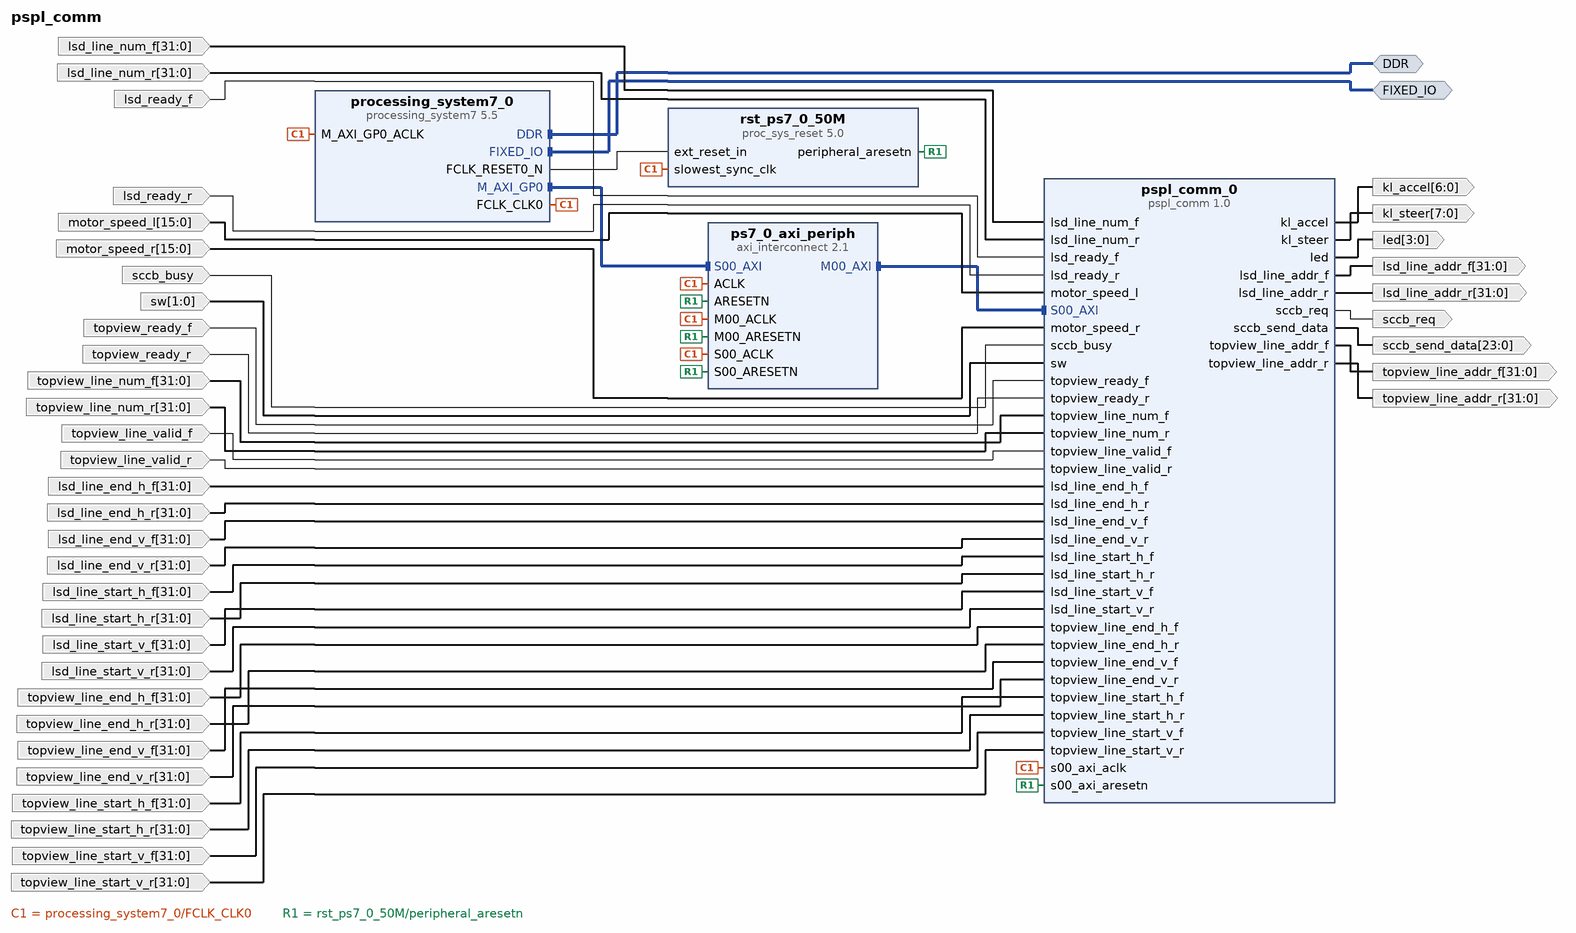
[diagram p0: block diagram of the top level]
# Vivado block design pspl_comm, xc7z020clg400-1, Vivado 2018.3
create_bd_design pspl_comm

create_bd_intf_port -mode Master -vlnv xilinx.com:interface:ddrx_rtl:1.0 DDR
create_bd_intf_port -mode Master -vlnv xilinx.com:display_processing_system7:fixedio_rtl:1.0 FIXED_IO
create_bd_port -dir O -from 3 -to 0 led
create_bd_port -dir O -from 31 -to 0 lsd_line_addr_f
create_bd_port -dir O -from 31 -to 0 lsd_line_addr_r
create_bd_port -dir I -from 31 -to 0 lsd_line_num_f
create_bd_port -dir I -from 31 -to 0 lsd_line_num_r
create_bd_port -dir I lsd_ready_f
create_bd_port -dir I lsd_ready_r
create_bd_port -dir I -from 15 -to 0 motor_speed_l
create_bd_port -dir I -from 15 -to 0 motor_speed_r
create_bd_port -dir I sccb_busy
create_bd_port -dir O sccb_req
create_bd_port -dir O -from 23 -to 0 sccb_send_data
create_bd_port -dir I -from 1 -to 0 sw
create_bd_port -dir O -from 31 -to 0 topview_line_addr_f
create_bd_port -dir O -from 31 -to 0 topview_line_addr_r
create_bd_port -dir I topview_ready_f
create_bd_port -dir I topview_ready_r
create_bd_port -dir O -from 6 -to 0 kl_accel
create_bd_port -dir O -from 7 -to 0 kl_steer
create_bd_port -dir I -from 31 -to 0 topview_line_num_f
create_bd_port -dir I -from 31 -to 0 topview_line_num_r
create_bd_port -dir I topview_line_valid_f
create_bd_port -dir I topview_line_valid_r
create_bd_port -dir I -from 31 -to 0 lsd_line_end_h_f
create_bd_port -dir I -from 31 -to 0 lsd_line_end_h_r
create_bd_port -dir I -from 31 -to 0 lsd_line_end_v_f
create_bd_port -dir I -from 31 -to 0 lsd_line_end_v_r
create_bd_port -dir I -from 31 -to 0 lsd_line_start_h_f
create_bd_port -dir I -from 31 -to 0 lsd_line_start_h_r
create_bd_port -dir I -from 31 -to 0 lsd_line_start_v_f
create_bd_port -dir I -from 31 -to 0 lsd_line_start_v_r
create_bd_port -dir I -from 31 -to 0 topview_line_end_h_f
create_bd_port -dir I -from 31 -to 0 topview_line_end_h_r
create_bd_port -dir I -from 31 -to 0 topview_line_end_v_f
create_bd_port -dir I -from 31 -to 0 topview_line_end_v_r
create_bd_port -dir I -from 31 -to 0 topview_line_start_h_f
create_bd_port -dir I -from 31 -to 0 topview_line_start_h_r
create_bd_port -dir I -from 31 -to 0 topview_line_start_v_f
create_bd_port -dir I -from 31 -to 0 topview_line_start_v_r

create_bd_cell -type ip -vlnv xilinx.com:ip:processing_system7:5.5 processing_system7_0
# 1 more settings of processing_system7_0 are not shown: defaults, MIO pin electricals, DDR timing, and values the tool derives
create_bd_cell -type ip -vlnv xilinx.com:ip:axi_interconnect:2.1 ps7_0_axi_periph
set_property -dict {CONFIG.NUM_MI 1} [get_bd_cells ps7_0_axi_periph]
create_bd_cell -type ip -vlnv xilinx.com:ip:proc_sys_reset:5.0 rst_ps7_0_50M
create_bd_cell -type ip -vlnv pcalab:user:pspl_comm:1.0 pspl_comm_0

# ---- connections ----

connect_bd_intf_net [get_bd_intf_pins ps7_0_axi_periph/M00_AXI] [get_bd_intf_pins pspl_comm_0/S00_AXI]
connect_bd_intf_net [get_bd_intf_pins processing_system7_0/M_AXI_GP0] [get_bd_intf_pins ps7_0_axi_periph/S00_AXI]
connect_bd_intf_net [get_bd_intf_ports DDR] [get_bd_intf_pins processing_system7_0/DDR]
connect_bd_intf_net [get_bd_intf_ports FIXED_IO] [get_bd_intf_pins processing_system7_0/FIXED_IO]
connect_bd_net [get_bd_pins processing_system7_0/FCLK_CLK0] \
  [get_bd_pins processing_system7_0/M_AXI_GP0_ACLK] [get_bd_pins ps7_0_axi_periph/S00_ACLK] \
  [get_bd_pins rst_ps7_0_50M/slowest_sync_clk] [get_bd_pins ps7_0_axi_periph/M00_ACLK] [get_bd_pins ps7_0_axi_periph/ACLK] \
  [get_bd_pins pspl_comm_0/s00_axi_aclk]
connect_bd_net [get_bd_pins processing_system7_0/FCLK_RESET0_N] [get_bd_pins rst_ps7_0_50M/ext_reset_in]
connect_bd_net [get_bd_pins rst_ps7_0_50M/peripheral_aresetn] \
  [get_bd_pins ps7_0_axi_periph/S00_ARESETN] [get_bd_pins ps7_0_axi_periph/M00_ARESETN] \
  [get_bd_pins ps7_0_axi_periph/ARESETN] [get_bd_pins pspl_comm_0/s00_axi_aresetn]
connect_bd_net [get_bd_pins pspl_comm_0/led] [get_bd_ports led]
connect_bd_net [get_bd_pins pspl_comm_0/lsd_line_addr_f] [get_bd_ports lsd_line_addr_f]
connect_bd_net [get_bd_pins pspl_comm_0/lsd_line_addr_r] [get_bd_ports lsd_line_addr_r]
connect_bd_net -net lsd_line_num_f_0_1 [get_bd_ports lsd_line_num_f] [get_bd_pins pspl_comm_0/lsd_line_num_f]
connect_bd_net -net lsd_line_num_r_0_1 [get_bd_ports lsd_line_num_r] [get_bd_pins pspl_comm_0/lsd_line_num_r]
connect_bd_net -net lsd_ready_f_0_1 [get_bd_ports lsd_ready_f] [get_bd_pins pspl_comm_0/lsd_ready_f]
connect_bd_net -net lsd_ready_r_0_1 [get_bd_ports lsd_ready_r] [get_bd_pins pspl_comm_0/lsd_ready_r]
connect_bd_net -net motor_speed_l_0_1 [get_bd_ports motor_speed_l] [get_bd_pins pspl_comm_0/motor_speed_l]
connect_bd_net -net motor_speed_r_0_1 [get_bd_ports motor_speed_r] [get_bd_pins pspl_comm_0/motor_speed_r]
connect_bd_net -net sccb_busy_0_1 [get_bd_ports sccb_busy] [get_bd_pins pspl_comm_0/sccb_busy]
connect_bd_net [get_bd_pins pspl_comm_0/sccb_req] [get_bd_ports sccb_req]
connect_bd_net [get_bd_pins pspl_comm_0/sccb_send_data] [get_bd_ports sccb_send_data]
connect_bd_net -net sw_0_1 [get_bd_ports sw] [get_bd_pins pspl_comm_0/sw]
connect_bd_net [get_bd_pins pspl_comm_0/topview_line_addr_f] [get_bd_ports topview_line_addr_f]
connect_bd_net [get_bd_pins pspl_comm_0/topview_line_addr_r] [get_bd_ports topview_line_addr_r]
connect_bd_net -net topview_ready_f_0_1 [get_bd_ports topview_ready_f] [get_bd_pins pspl_comm_0/topview_ready_f]
connect_bd_net -net topview_ready_r_0_1 [get_bd_ports topview_ready_r] [get_bd_pins pspl_comm_0/topview_ready_r]
connect_bd_net [get_bd_pins pspl_comm_0/kl_accel] [get_bd_ports kl_accel]
connect_bd_net [get_bd_pins pspl_comm_0/kl_steer] [get_bd_ports kl_steer]
connect_bd_net -net topview_line_num_f_0_1 [get_bd_ports topview_line_num_f] [get_bd_pins pspl_comm_0/topview_line_num_f]
connect_bd_net -net topview_line_num_r_0_1 [get_bd_ports topview_line_num_r] [get_bd_pins pspl_comm_0/topview_line_num_r]
connect_bd_net -net topview_line_valid_f_0_1 [get_bd_ports topview_line_valid_f] [get_bd_pins pspl_comm_0/topview_line_valid_f]
connect_bd_net -net topview_line_valid_r_0_1 [get_bd_ports topview_line_valid_r] [get_bd_pins pspl_comm_0/topview_line_valid_r]
connect_bd_net -net lsd_line_end_h_f_0_1 [get_bd_ports lsd_line_end_h_f] [get_bd_pins pspl_comm_0/lsd_line_end_h_f]
connect_bd_net -net lsd_line_end_h_r_0_1 [get_bd_ports lsd_line_end_h_r] [get_bd_pins pspl_comm_0/lsd_line_end_h_r]
connect_bd_net -net lsd_line_end_v_f_0_1 [get_bd_ports lsd_line_end_v_f] [get_bd_pins pspl_comm_0/lsd_line_end_v_f]
connect_bd_net -net lsd_line_end_v_r_0_1 [get_bd_ports lsd_line_end_v_r] [get_bd_pins pspl_comm_0/lsd_line_end_v_r]
connect_bd_net -net lsd_line_start_h_f_0_1 [get_bd_ports lsd_line_start_h_f] [get_bd_pins pspl_comm_0/lsd_line_start_h_f]
connect_bd_net -net lsd_line_start_h_r_0_1 [get_bd_ports lsd_line_start_h_r] [get_bd_pins pspl_comm_0/lsd_line_start_h_r]
connect_bd_net -net lsd_line_start_v_f_0_1 [get_bd_ports lsd_line_start_v_f] [get_bd_pins pspl_comm_0/lsd_line_start_v_f]
connect_bd_net -net lsd_line_start_v_r_0_1 [get_bd_ports lsd_line_start_v_r] [get_bd_pins pspl_comm_0/lsd_line_start_v_r]
connect_bd_net -net topview_line_end_h_f_0_1 [get_bd_ports topview_line_end_h_f] [get_bd_pins pspl_comm_0/topview_line_end_h_f]
connect_bd_net -net topview_line_end_h_r_0_1 [get_bd_ports topview_line_end_h_r] [get_bd_pins pspl_comm_0/topview_line_end_h_r]
connect_bd_net -net topview_line_end_v_f_0_1 [get_bd_ports topview_line_end_v_f] [get_bd_pins pspl_comm_0/topview_line_end_v_f]
connect_bd_net -net topview_line_end_v_r_0_1 [get_bd_ports topview_line_end_v_r] [get_bd_pins pspl_comm_0/topview_line_end_v_r]
connect_bd_net -net topview_line_start_h_f_0_1 [get_bd_ports topview_line_start_h_f] [get_bd_pins pspl_comm_0/topview_line_start_h_f]
connect_bd_net -net topview_line_start_h_r_0_1 [get_bd_ports topview_line_start_h_r] [get_bd_pins pspl_comm_0/topview_line_start_h_r]
connect_bd_net -net topview_line_start_v_f_0_1 [get_bd_ports topview_line_start_v_f] [get_bd_pins pspl_comm_0/topview_line_start_v_f]
connect_bd_net -net topview_line_start_v_r_0_1 [get_bd_ports topview_line_start_v_r] [get_bd_pins pspl_comm_0/topview_line_start_v_r]

# ---- address map ----
assign_bd_address -offset 0x43C00000 -range 64K -target_address_space [get_bd_addr_spaces processing_system7_0/Data] [get_bd_addr_segs pspl_comm_0/S00_AXI/S00_AXI_reg]

validate_bd_design
save_bd_design
